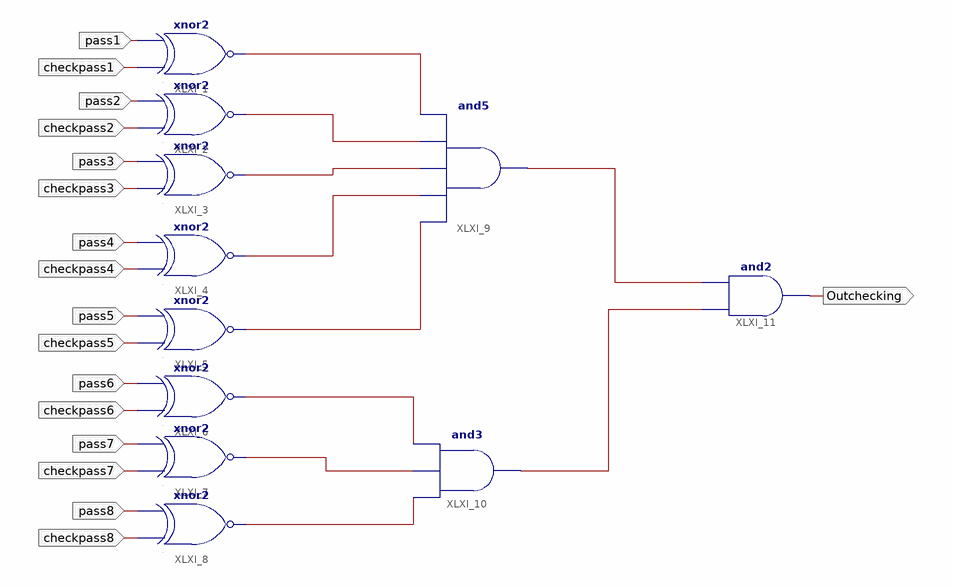
[diagram p0: schematic sheet 1]
// Xilinx ISE schematic checking.sch (spartan6) as structural Verilog: 11 symbols, 17 ports
module checking (
  input  pass1,
  input  pass2,
  input  pass3,
  input  checkpass2,
  input  checkpass1,
  input  checkpass3,
  input  pass4,
  input  checkpass4,
  input  pass5,
  input  checkpass5,
  input  pass6,
  input  checkpass6,
  input  pass7,
  input  checkpass7,
  input  pass8,
  input  checkpass8,
  output Outchecking
);

  wire XLXN_18, XLXN_19, XLXN_20, XLXN_21, XLXN_22, XLXN_23, XLXN_24, XLXN_25, XLXN_27, XLXN_28;

  xnor XLXI_1 (XLXN_18, checkpass1, pass1);
  xnor XLXI_2 (XLXN_19, checkpass2, pass2);
  xnor XLXI_3 (XLXN_20, checkpass3, pass3);
  xnor XLXI_4 (XLXN_21, checkpass4, pass4);
  xnor XLXI_5 (XLXN_22, checkpass5, pass5);
  xnor XLXI_6 (XLXN_23, checkpass6, pass6);
  xnor XLXI_7 (XLXN_24, checkpass7, pass7);
  xnor XLXI_8 (XLXN_25, checkpass8, pass8);
  and XLXI_9 (XLXN_27, XLXN_22, XLXN_21, XLXN_20, XLXN_19, XLXN_18);
  and XLXI_10 (XLXN_28, XLXN_25, XLXN_24, XLXN_23);
  and XLXI_11 (Outchecking, XLXN_28, XLXN_27);
endmodule
